# EAGLE design Brickster 8884bt Receiver (EAGLE 6.5.0)
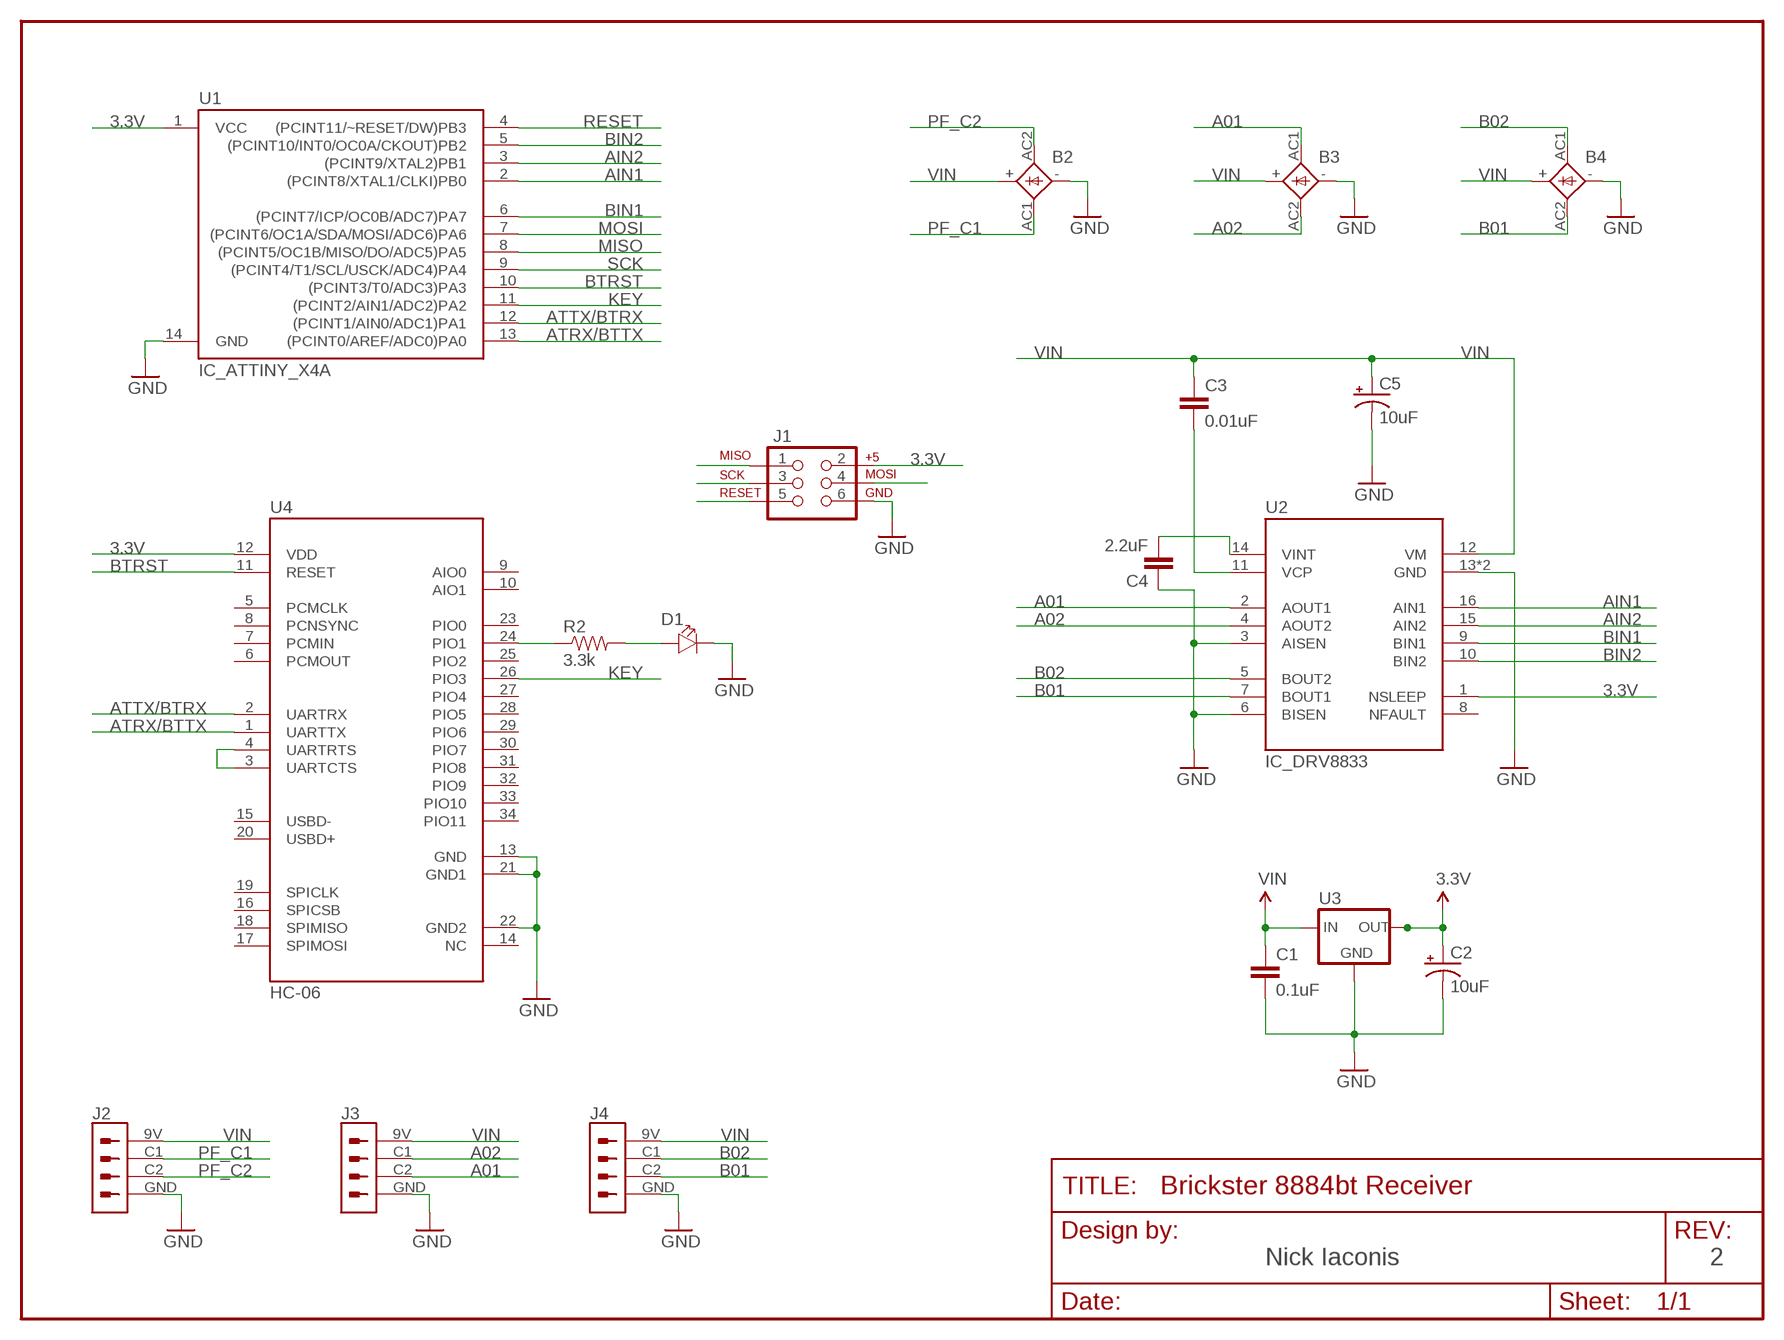
[diagram p0: schematic, sheet 1]

## Parts
B2  B_CDBHM240L-HF  [MBS-2]
B3  B_CDBHM240L-HF  [MBS-2]
B4  B_CDBHM240L-HF  [MBS-2]
C1  0.1uF  C0805  [0805]
C2  10uF  C_POL  [1206]
C3  0.01uF  C0805  [0805]
C4  2.2uF  C0805  [0805]
C5  10uF  C_POL  [1206]
D1  LED0805  [0805_POL]
J1  AVR_SPI_PRG_6NS  [2X3-NS]
J2  CON_PF_SMD  [SMD_PF]
J3  CON_PF_SMD  [SMD_PF]
J4  CON_PF_SMD  [SMD_PF]
R2  3.3k  R0805  [0805]
U1  IC_ATTINY_X4A  [14S1]
U2  IC_DRV8833  [PWP_R-PDSO-G16]
U3  IC_RT9164A  [SOT223]
U4  HC-06  [BLUETOOTH_SMD]

## Nets
3.3V: C2.1(+) J1.2 U1.1(VCC) U2.1(NSLEEP) U3.2(OUT) U3.4 U4.12(VDD)
A01: B3.AC1 J3.C2 U2.2(AOUT1)
A02: B3.AC2 J3.C1 U2.4(AOUT2)
AIN1: U1.2((PCINT8/XTAL1/CLKI)PB0) U2.16(AIN1)
AIN2: U1.3((PCINT9/XTAL2)PB1) U2.15(AIN2)
ATRX/BTTX: U1.13((PCINT0/AREF/ADC0)PA0) U4.1(UARTTX)
ATTX/BTRX: U1.12((PCINT1/AIN0/ADC1)PA1) U4.2(UARTRX)
B01: B4.AC2 J4.C2 U2.7(BOUT1)
B02: B4.AC1 J4.C1 U2.5(BOUT2)
BIN1: U1.6((PCINT7/ICP/OC0B/ADC7)PA7) U2.9(BIN1)
BIN2: U1.5((PCINT10/INT0/OC0A/CKOUT)PB2) U2.10(BIN2)
BTRST: U1.10((PCINT3/T0/ADC3)PA3) U4.11(RESET)
GND: B2.- B3.- B4.- C1.P$2 C2.2(-) C4.P$1 C5.2(-) D1.P$1 J1.6 J2.GND J3.GND J4.GND U1.14(GND) U2.3(AISEN) U2.6(BISEN) U2.13(GND) U2.17(GND) U3.1(GND) U4.13(GND) U4.21(GND1) U4.22(GND2)
KEY: U1.11((PCINT2/AIN1/ADC2)PA2) U4.26(PIO3)
LED: R2.P$1 U4.24(PIO1)
MISO: J1.1 U1.8((PCINT5/OC1B/MISO/DO/ADC5)PA5)
MOSI: J1.4 U1.7((PCINT6/OC1A/SDA/MOSI/ADC6)PA6)
N$1: C3.P$2 U2.11(VCP)
N$2: C4.P$2 U2.14(VINT)
N$3: U4.3(UARTCTS) U4.4(UARTRTS)
N$4: D1.P$2 R2.P$2
PF_C1: B2.AC1 J2.C1
PF_C2: B2.AC2 J2.C2
RESET: J1.5 U1.4((PCINT11/~RESET/DW)PB3)
SCK: J1.3 U1.9((PCINT4/T1/SCL/USCK/ADC4)PA4)
VIN: B2.+ B3.+ B4.+ C1.P$1 C3.P$1 C5.1(+) J2.9V J3.9V J4.9V U2.12(VM) U3.3(IN)
Unconnected: U2.8(NFAULT) U4.5(PCMCLK) U4.6(PCMOUT) U4.7(PCMIN) U4.8(PCNSYNC) U4.9(AIO0) U4.10(AIO1) U4.14(NC) U4.15(USBD-) U4.16(SPICSB) U4.17(SPIMOSI) U4.18(SPIMISO) U4.19(SPICLK) U4.20(USBD+) U4.23(PIO0) U4.25(PIO2) U4.27(PIO4) U4.28(PIO5) U4.29(PIO6) U4.30(PIO7) U4.31(PIO8) U4.32(PIO9) U4.33(PIO10) U4.34(PIO11)

## Notes on the sheet
- Nick Iaconis | 2

## Library data of the parts
B2-B4 = brickster:B_CDBHM240L-HF
C1 C3 C4 = brickster:C
C2 C5 = brickster:C_POL
D1 = brickster:LED
J1 = SparkFun-Connectors:AVR_SPI_PRG_6: AVR ISP 6 Pin This is the reduced ISP connector for AVR programming. Common on Arduino. This footprint will take up less PCB space and can be used with a 10-pin to 6-pin adapter such as SKU: BOB-08508
J2-J4 = brickster:CON_PF
R2 = brickster:R
U1 = brickster:IC_ATTINY_X4A: Atmel ATtiny24A/44A/84A
U2 = brickster:IC_DRV8833
U3 = brickster:IC_RT9164A
U4 = brickster:HC-06

## Board
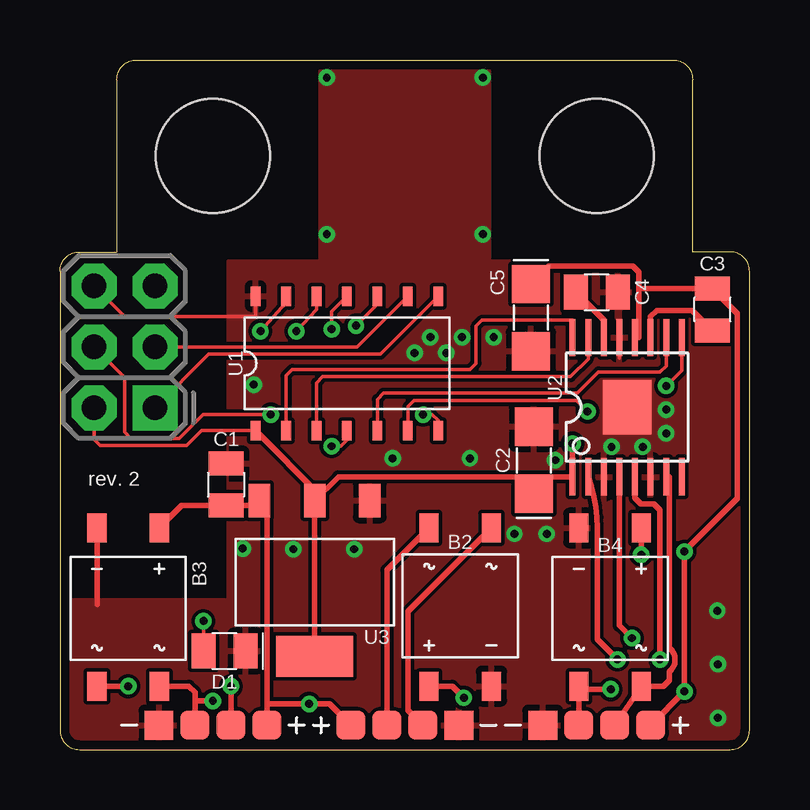
[diagram p1: board, top side]
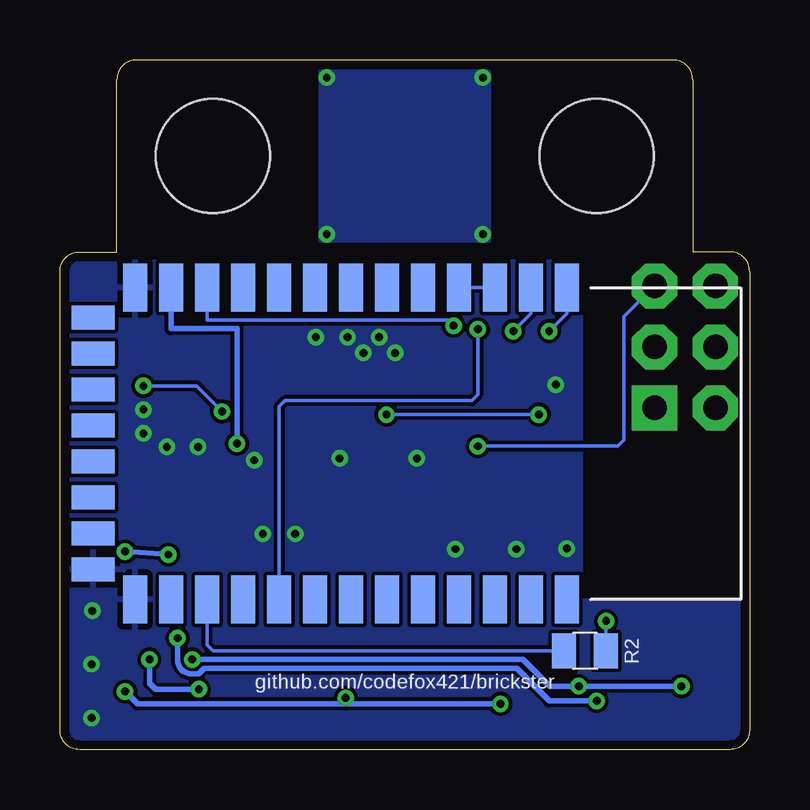
[diagram p2: board, bottom side, seen from below]

Size 28.75 x 28.75 mm. Coordinates in mm from the lower left corner, seen from the top.
Outline: 0.81,0 27.94,0 arc90 28.75,0.81 28.75,19.94 arc90 27.94,20.75 26.38,20.75 26.38,27.94 arc90 25.57,28.75 3.19,28.75 arc90 2.38,27.94 2.38,20.75 0.81,20.75 arc90 0,19.94 0,0.81 arc90 0.81,0
Copper layers (1*16): Top 0.0356mm / dielectric 1.5011mm / Bottom 0.0356mm
Design rules "LaenPCBOrder *": minimum track width 6mil, minimum drill 13mil, track to track 6mil, track to pad 6mil, pad to pad 6mil, via to via 6mil, smd to smd 6mil, copper to edge 15mil, drill to drill 6mil, minimum pad ring 7mil, minimum via ring 7mil, stop-mask expansion 4mil, vias tented up to drill 13mil, thermal gap 10mil
Holes 4.75 mm at 6.38,24.75 22.38,24.75

### Footprints (pad centres in the part's own frame; a part is rotated, then mirrored left to right if it is on the bottom)
MBS-2 = smd 0.8 x 1.2: + 1.3,3.3; - -1.3,3.3; AC1 -1.3,-3.3; AC2 1.3,-3.3
0805 = smd 1 x 1.45: P$1 0.875,0; P$2 -0.875,0
1206 = smd 1.6 x 1.6: 1 -1.4,0; 2 1.4,0
0805_POL = smd 1 x 1.45: P$1 0.875,0; P$2 -0.875,0
2X3-NS = drill 1.016 pad 1.88 square: 1 -2.54,-1.27 | drill 1.016 pad 1.88 octagon: 2 -2.54,1.27; 3 0,-1.27; 4 0,1.27; 5 2.54,-1.27; 6 2.54,1.27
SMD_PF = smd 1.206 x 1.206: 9V -2.25,0; C1 0.75,0; C2 -0.75,0; GND 2.25,0
14S1 = smd 0.813 x 0.406: 1 -2.8,3.81; 2 -2.8,2.54; 3 -2.8,1.27; 4 -2.8,0; 5 -2.8,-1.27; 6 -2.8,-2.54; 7 -2.8,-3.81; 8 2.8,-3.81; 9 2.8,-2.54; 10 2.8,-1.27; 11 2.8,0; 12 2.8,1.27; 13 2.8,2.54; 14 2.8,3.81
PWP_R-PDSO-G16 = smd 0.25 x 1.55: 1 -2.275,-2.9; 2 -1.625,-2.9; 3 -0.975,-2.9; 4 -0.325,-2.9; 5 0.325,-2.9; 6 0.975,-2.9; 7 1.625,-2.9; 8 2.275,-2.9; 9 2.275,2.9; 10 1.625,2.9; 11 0.975,2.9; 12 0.325,2.9; 13 -0.325,2.9; 14 -0.975,2.9; 15 -1.625,2.9; 16 -2.275,2.9 | smd 2.03 x 2.26: 17 0,0
SOT223 = smd 0.9 x 1.4: 1 -2.3,-3.4; 2 0,-3.4; 3 2.3,-3.4 | smd 3.2 x 1.7: 4 0,3.1
BLUETOOTH_SMD = smd 2 x 1: 1 -6.35,5.08; 2 -6.35,3.58; 3 -6.35,2.08; 4 -6.35,0.58; 5 -6.35,-0.92; 6 -6.35,-2.42; 7 -6.35,-3.92; 8 -6.35,-5.42; 9 -6.35,-6.92; 10 -6.35,-8.42; 11 -6.35,-9.92; 12 -6.35,-11.42; 13 -6.35,-12.92; 22 6.65,-12.92; 23 6.65,-11.42; 24 6.65,-9.92; 25 6.65,-8.42; 26 6.65,-6.92; 27 6.65,-5.42; 28 6.65,-3.92; 29 6.65,-2.42; 30 6.65,-0.92; 31 6.65,0.58; 32 6.65,2.08; 33 6.65,3.58; 34 6.65,5.08 | smd 1 x 1.8: 14 -5.1,-14.67; 15 -3.6,-14.67; 16 -2.1,-14.67; 17 -0.6,-14.67; 18 0.9,-14.67; 19 2.4,-14.67; 20 3.9,-14.67; 21 5.4,-14.67

### Placement (x,y rotation side)
B2  16.69,5.94 180 top
B3  2.84,5.94 0 top
B4  22.94,5.94 0 top
C1  6.92,11.05 270 top
C2  19.76,12.06 90 top
C3  27.2,18.35 90 top
C4  22.38,19.08 0 top
C5  19.63,18.01 270 top
D1  6.86,4.11 0 top
J1  2.69,16.79 90 top
J2  14.38,1.02 0 top
J3  6.38,1.02 180 top
J4  22.38,1.02 180 top
LOGO1  OSHW-LOGOM  [OSHW-LOGO-M-MASK]  14.38,25.4 0 top
LOGO2  OSHW-LOGOM  [OSHW-LOGO-M-MASK]  14.38,25.4 0 bottom
R2  6.86,4.11 180 bottom
U1  11.96,16.1 90 top
U2  23.65,14.27 0 top
U3  10.62,6.99 180 top
U4  12.7,12.9 270 bottom

### Tracks (layer width: path | path; a pad name or v marks a point on that pad's centre or on a via)
3.3V  (via drill 0.33)
  Top 0.152: J1.2 1.42,12.93 1.68,12.68 5.28,12.68 5.91,13.3 U1.1
  Top 0.229: U3.2 U3.4 | U1.1 10.87,10.59 U3.2 | v21.37,12.76 U2.1 19.41,11.38 | 19.41,11.38 11.61,11.38 U3.2 | C2.1 19.41,11.38
  Bottom 0.229: v21.37,12.76 21.37,17.55 24.12,17.55 U4.12
A01  (via drill 0.33)
  Top 0.229: B3.AC1 v2.85,2.64 | v23.24,3.76 22.4,4.6 22.4,9.25 arc20 U2.2 | J3.C2 v7.12,2.64
  Bottom 0.229: v2.85,2.64 v7.12,2.64 8.33,2.64 9.45,3.76 v23.24,3.76
A02  (via drill 0.33)
  Top 0.229: B3.AC2 5.37,2.64 5.62,2.39 J3.C1 5.62,2.03 v6.38,2.03 | v23.85,4.65 23.32,5.18 U2.4
  Bottom 0.229: v6.38,2.03 8.36,2.03 9.7,3.38 22.73,3.38 22.96,3.15 23.24,3.15 arc90 23.85,3.76 v23.85,4.65
AIN1
  Top 0.152: U1.2 9.42,15.6 9.68,15.85 17.09,15.85 17.35,16.1 17.35,17.65 17.6,17.91 21.37,17.91 U2.16
AIN2
  Top 0.152: U1.3 10.69,15.29 10.95,15.54 21.29,15.54 22.02,16.28 U2.15
ATRX/BTTX  (via drill 0.33)
  Top 0.152: U1.13 9.42,18.64 v8.36,17.45
  Bottom 0.152: U4.1 7.62,18.19 v8.36,17.45
ATTX/BTRX  (via drill 0.33)
  Top 0.152: U1.12 10.69,18.34 v9.86,17.45
  Bottom 0.152: U4.2 9.12,18.18 v9.86,17.45
B01
  Top 0.229: J4.C2 B4.AC2 25.15,2.64 25.4,2.9 25.4,3.25 arc105 25.4,4.24 25.4,11.38 U2.7
B02  (via drill 0.33)
  Top 0.229: J4.C1 B4.AC1 21.64,2.52 v22.96,2.52 | U2.5 23.97,10.49 24.23,10.24 24.77,10.24 25.02,9.98 v25.02,3.76
  Bottom 0.229: v25.02,3.76 25.02,2.77 24.77,2.52 v22.96,2.52
BIN1  (via drill 0.33)
  Top 0.152: U1.6 14.5,14.3 14.76,14.55 21.54,14.55 v22,14.1 | v25.27,15.16 25.92,15.81 U2.9
  Bottom 0.152: v22,14.1 23.06,15.16 v25.27,15.16
BIN2
  Top 0.152: U2.10 25.27,16 25.02,15.75 22.45,15.75 21.57,14.86 13.49,14.86 13.23,14.61 U1.5
BTRST  (via drill 0.33)
  Top 0.152: v12.34,17.68 13.23,18.57 U1.10
  Bottom 0.152: U4.11 22.62,17.91 12.57,17.91 v12.34,17.68
GND  (via drill 0.33)
  Top 0.152: U1.14 8.15,18.06 2.69,18.06 J1.6 | 23.32,16.33 U2.13
  Top 0.229: B3.- 1.54,6.04
  other vias: 7.62,8.38 9.73,8.36 12.27,8.36 17.09,12.14 13.87,12.14 15.44,17.2 18.08,17.2 20.65,12.06 23,12.62 24.3,12.62 25.27,13.18 25.27,14.17 18.95,8.99 20.29,8.99 11.13,21.49 17.63,21.49 17.63,28.02 11.13,28.02 16.76,17.2 16.1,16.54 14.78,16.54 8.08,15.21 27.43,1.32 27.41,5.79 27.43,3.56
  pour Bottom: 0.38,0.38 28.37,0.38 28.37,20.37 7.01,20.37 7.01,6.25 0.38,6.25
  pour Top: 0.38,0.38 28.37,0.38 28.37,20.37 7.01,20.37 7.01,6.25 0.38,6.25
  pour Bottom: 10.85,21.21 10.85,28.3 17.91,28.3 17.91,21.21
  pour Top: 10.85,20.29 17.91,20.29 17.91,28.3 10.85,28.3
KEY  (via drill 0.33)
  Top 0.152: U1.11 11.33,18.27 v11.33,17.53
  Bottom 0.152: v11.33,17.53 11.33,14.81 11.58,14.55 19.37,14.55 19.62,14.3 U4.26
LED
  Bottom 0.152: R2.P$1 22.37,4.12 22.62,4.37 U4.24
MISO
  Top 0.152: J1.1 6.2,16.48 13.35,16.48 U1.8
MOSI  (via drill 0.33)
  Top 0.152: J1.4 2.69,15.52 2.69,13.23 2.95,12.98 4.98,12.98 5.97,13.97 v8.79,13.97 | v15.14,13.97 15.52,13.97 15.77,13.72 U1.7
  Bottom 0.152: v8.79,13.97 v15.14,13.97
N$1
  Top 0.229: U2.11 24.62,18.06 24.88,18.31 26.37,18.31 C3.P$2
N$2
  Top 0.229: C4.P$2 22.67,17.91 U2.14
N$3
  Bottom 0.152: U4.3 U4.4
N$4  (via drill 0.33)
  Top 0.152: D1.P$2 v5.98,5.36
  Bottom 0.152: v5.98,5.36 D1.P$2
PF_C1
  Top 0.229: J2.C1 14.5,1.64 14.5,5.76 B2.AC1
PF_C2
  Top 0.229: J2.C2 13.63,7.48 B2.AC2
RESET  (via drill 0.33)
  Top 0.152: U1.4 11.96,12.9 11.71,12.65 v11.33,12.65
  Bottom 0.152: v11.33,12.65 5.49,12.65 5.23,12.9 5.23,18.06 J1.5
SCK
  Top 0.152: J1.3 12.39,16.79 U1.9
VIN  (via drill 0.33)
  Top 0.229: B3.+ 5.08,10.17 C1.P$1 8.57,10.17 U3.3 8.62,10.38 J3.9V 8.62,1.91 v10.39,1.91 11.24,1.91 J2.9V | B4.+ v24.23,8.13 | J4.9V v26.04,2.42 v26.04,8.26 28.25,10.46 28.25,18.18 C3.P$1 24.13,19.23 | U2.12 24.13,17.18 24.13,19.23 | C5.1 20.39,20.17 23.88,20.17 24.13,19.91 24.13,19.23 | B2.+ 16.36,2.64 v16.84,2.16
  Bottom 0.229: v24.23,8.13 v26.04,8.26 | v10.39,1.91 16.82,1.91 | 16.82,1.91 25.52,1.91 v26.04,2.42 | v16.84,2.16 16.84,1.93 16.82,1.91

### Text on the board
tPlace: rev. 2
bPlace: github.com/codefox421/brickster
tStop: BricksTer / 8884bt
bStop: BricksTer / 8884bt